# EAGLE design GreenProbe (EAGLE 9.7.0)
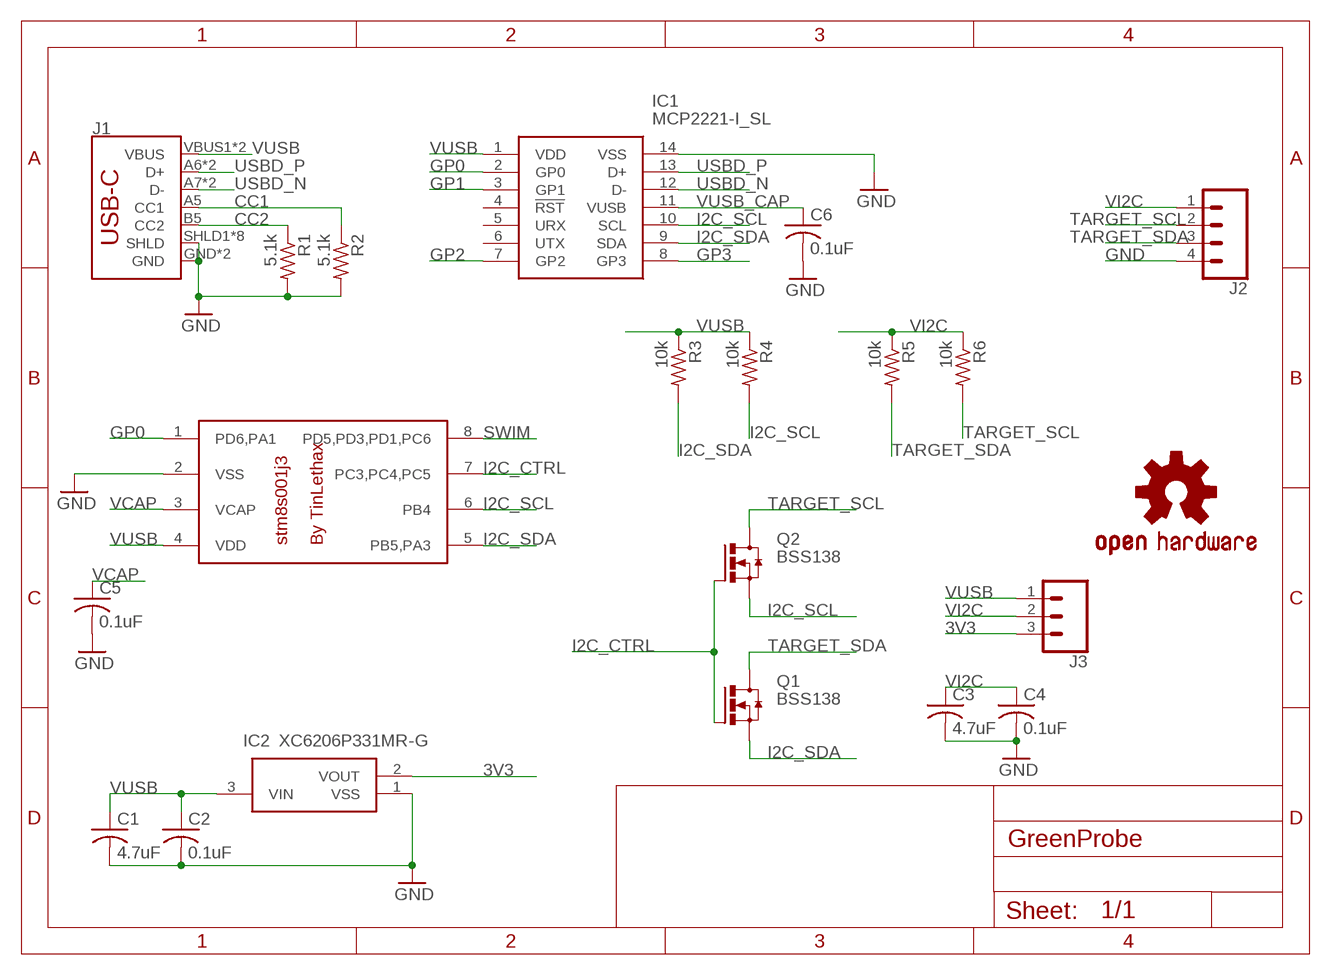
[diagram p0: schematic, sheet 1]

## Parts
C1  4.7uF  C-USC0603  [C0603]
C2  0.1uF  C-USC0603  [C0603]
C3  4.7uF  C-USC0603  [C0603]
C4  0.1uF  C-USC0603  [C0603]
C5  0.1uF  C-USC0603  [C0603]
C6  0.1uF  C-USC0603  [C0603]
IC1  MCP2221-I_SL  [SOIC127P600X175-14N]
IC2  XC6206P331MR-G  [SOT95P280X130-3N]
IC3  STM8S001J3  [SOP8]
J1  SPARKFUN-CONNECTORS_USB_C16PIN  [SPARKFUN-CONNECTORS_USB-C-16P]
J2  CONN_041X04_NO_SILK  [1X04_NO_SILK]
J3  CONN_031X03_NO_SILK  [1X03_NO_SILK]
LOGO1  OSHW-LOGOMINI  [OSHW-LOGO-MINI]
Q1  BSS138  [SOT23-3]
Q2  BSS138  [SOT23-3]
R1  5.1k  R-US_R0603  [R0603]
R2  5.1k  R-US_R0603  [R0603]
R3  10k  R-US_R0603  [R0603]
R4  10k  R-US_R0603  [R0603]
R5  10k  R-US_R0603  [R0603]
R6  10k  R-US_R0603  [R0603]

## Nets
3V3: IC2.2(VOUT) J3.3
CC1: J1.A5(CC1) R2.1
CC2: J1.B5(CC2) R1.1
GND: C1.2 C2.2 C3.2 C4.2 C5.2 C6.2 IC1.14(VSS) IC2.1(VSS) IC3.2(VSS) J1.GND J1.GND2(GND) J1.SHLD1(SHLD) J1.SHLD2(SHLD) J1.SHLD3(SHLD) J1.SHLD4(SHLD) J1.SHLD5(SHLD) J1.SHLD6(SHLD) J1.SHLD7(SHLD) J1.SHLD8(SHLD) J2.4 R1.2 R2.2
GP0: IC1.2(GP0) IC3.1(PD6,PA1)
GP1: IC1.3(GP1)
GP2: IC1.7(GP2)
GP3: IC1.8(GP3)
I2C_CTRL: IC3.7(PC3,PC4,PC5) Q1.1(G) Q2.1(G)
I2C_SCL: IC1.10(SCL) IC3.6(PB4) Q2.2(S) R4.2
I2C_SDA: IC1.9(SDA) IC3.5(PB5,PA3) Q1.2(S) R3.2
SWIM: IC3.8(PD5,PD3,PD1,PC6)
TARGET_SCL: J2.2 Q2.3(D) R6.2
TARGET_SDA: J2.3 Q1.3(D) R5.2
USBD_N: IC1.12(D-) J1.A7(D-) J1.B7(D-)
USBD_P: IC1.13(D+) J1.A6(D+) J1.B6(D+)
VCAP: C5.1 IC3.3(VCAP)
VI2C: C3.1 C4.1 J2.1 J3.2 R5.1 R6.1
VUSB: C1.1 C2.1 IC1.1(VDD) IC2.3(VIN) IC3.4(VDD) J1.VBUS1(VBUS) J1.VBUS2(VBUS) J3.1 R3.1 R4.1
VUSB_CAP: C6.1 IC1.11(VUSB)
Unconnected: IC1.4(!RST) IC1.5(URX) IC1.6(UTX)

## Library data of the parts
C1-C6 = adafruit:C-US: CAPACITOR, American symbol
IC1 = MCP2221-I_SL:MCP2221-I_SL: USB 2.0 to I2C/UART Converter GPIO SO14 Microchip MCP2221-I/SL, USB Converter, USB 2.0 at 12Mbit/s, 3 5.5 V, 14-Pin SOIC Source: Datasheet <https://datasheet.datasheetarchive.com/originals/distributors/DKDS-15/280084.pdf>; ARROW_PART_NUMBER: MCP2221-I/SL; ARROW_PRICE-STOCK: https://www.arrow.com/en/products/mcp2221-isl/microchip-technology?region=nac; DESCRIPTION: USB 2.0 to I2C/UART Converter GPIO SO14 Microchip MCP2221-I/SL, USB Converter, USB 2.0 at 12Mbit/s, 3 5.5 V, 14-Pin SOIC; HEIGHT: 1.75mm; MANUFACTURER_NAME: Microchip; MANUFACTURER_PART_NUMBER: MCP2221-I/SL; MOUSER_PART_NUMBER: 579-MCP2221-I/SL; MOUSER_PRICE-STOCK: https://www.mouser.co.uk/ProductDetail/Microchip-Technology/MCP2221-I-SL?qs=wzzOUr4NhYrXnl%252BgbTV6ag%3D%3D
IC2 = XC6206P331MR-G:XC6206P331MR-G: LDO Voltage Regulators Source: Datasheet <https://www.torexsemi.com/file/xc6206/XC6206.pdf>; DESCRIPTION: LDO Voltage Regulators; HEIGHT: 1.3mm; MANUFACTURER_NAME: Torex; MANUFACTURER_PART_NUMBER: XC6206P331MR-G; MOUSER_PART_NUMBER: 865-XC6206P331MR-G; MOUSER_PRICE-STOCK: https://www.mouser.co.uk/ProductDetail/Torex-Semiconductor/XC6206P331MR-G?qs=AsjdqWjXhJ%252B7jjWBpr1yow%3D%3D
IC3 = stm8s001j3:STM8S001J3
J1 = USB-C-Breakout:SPARKFUN-CONNECTORS_USB_C: USB Type C 16Pin Connector Super Speed pins not available on the 16-pin purely SMD connector so this part is best for USB 2.0 implementations. D1 and D2 are tied together enabling D+/- no matter which way the cable is plugged into the connector. The two channel configuration pins (CC1/2) are exposed. These are normally connected to ground via 5.1k resistors but can be reconfigured for high current/high power applications.; PROD_ID: CONN-14122
J2 = SparkFun-Connectors:CONN_04: Multi connection point. Often used as Generic Header-pin footprint for 0.1 inch spaced/style header connections On any of the 0.1 inch spaced packages, you can populate with these: Break Away Headers - Straight <https://www.sparkfun.com/products/116> (PRT-00116) Break Away Male Headers - Right Angle <https://www.sparkfun.com/products/553> (PRT-00553) Female Headers <https://www.sparkfun.com/products/115> (PRT-00115) Break Away Headers - Machine Pin <https://www.sparkfun.com/products/117> (PRT-00117) Break Away Female Headers - Swiss Machine Pin <https://www.sparkfun.com/products/743> (PRT-00743) For SCREWTERMINALS and SPRING TERMINALS visit here: Screw Terimnals on SparkFun.com <https://www.sparkfun.com/search/results?term=Screw+Terminals> (5mm/3.5mm/2.54mm spacing) This device is also useful as a general connection point to wire up your design to another part of your project. Our various solder wires solder well into these plated through hole pads. Hook-Up Wire - Assortment (Stranded, 22 AWG) <https://www.sparkfun.com/products/11375> (PRT-11375) Hook-Up Wire - Assortment (Solid Core, 22 AWG) <https://www.sparkfun.com/products/11367> (PRT-11367) View the entire wire category on our website here <https://www.sparkfun.com/categories/141> Special notes: Molex polarized connector foot print use with SKU : PRT-08231 with associated crimp pins and housings. 1MM SMD Version SKU: PRT-10208; PROD_ID: CONN-09696
J3 = SparkFun-Connectors:CONN_03: Multi connection point. Often used as Generic Header-pin footprint for 0.1 inch spaced/style header connections On any of the 0.1 inch spaced packages, you can populate with these: Break Away Headers - Straight <https://www.sparkfun.com/products/116> (PRT-00116) Break Away Male Headers - Right Angle <https://www.sparkfun.com/products/553> (PRT-00553) Female Headers <https://www.sparkfun.com/products/115> (PRT-00115) Break Away Headers - Machine Pin <https://www.sparkfun.com/products/117> (PRT-00117) Break Away Female Headers - Swiss Machine Pin <https://www.sparkfun.com/products/743> (PRT-00743) Stackable Header - 3 Pin (Female, 0.1") <https://www.sparkfun.com/products/13875> (PRT-13875) For SCREWTERMINALS and SPRING TERMINALS visit here: Screw Terimnals on SparkFun.com <https://www.sparkfun.com/search/results?term=Screw+Terminals> (5mm/3.5mm/2.54mm spacing) This device is also useful as a general connection point to wire up your design to another part of your project. Our various solder wires solder well into these plated through hole pads. Hook-Up Wire - Assortment (Stranded, 22 AWG) <https://www.sparkfun.com/products/11375> (PRT-11375) Hook-Up Wire - Assortment (Solid Core, 22 AWG) <https://www.sparkfun.com/products/11367> (PRT-11367) View the entire wire category on our website here <https://www.sparkfun.com/categories/141> Special notes: Molex polarized connector foot print use with SKU : PRT-08232 with associated crimp pins and housings.
LOGO1 = SparkFun-Aesthetics:OSHW-LOGO: Open-Source Hardware (OSHW) Logo This logo indicates the piece of hardware it is found on incorporates a OSHW license and/or adheres to the definition of open source hardware found here: http://freedomdefined.org/OSHW
Q1 Q2 = Transistor:BSS138: MOSFET N-CH 50V 220MA SOT-23 Manufacturer's datasheet <https://www.onsemi.com/pub/Collateral/BSS138-D.PDF>; CREATED_BY: PCBLayout.com; DIGIKEY_PART_NUMBER: BSS138CT-ND; MANUFACTURER: ON Semiconductor; MPN: BSS138; PACKAGE: SOT-23
R1-R6 = adafruit:R-US_: RESISTOR, American symbol

## Board
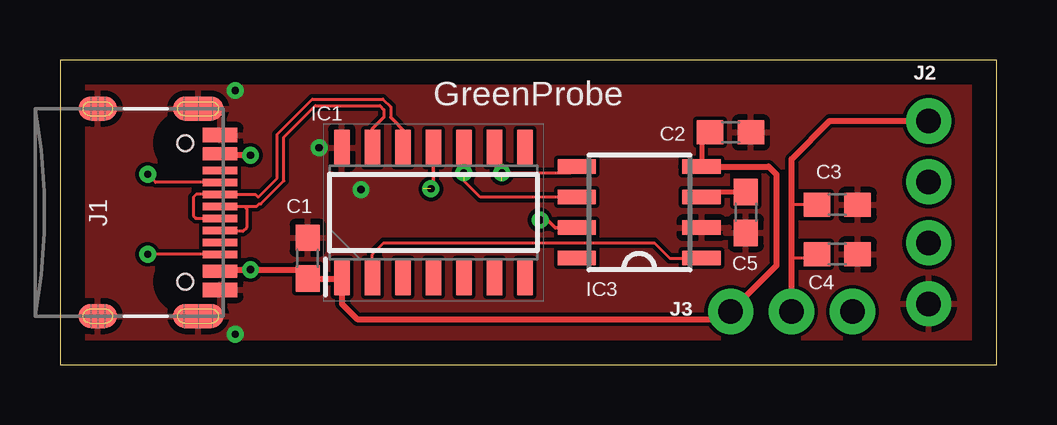
[diagram p1: board, top side]
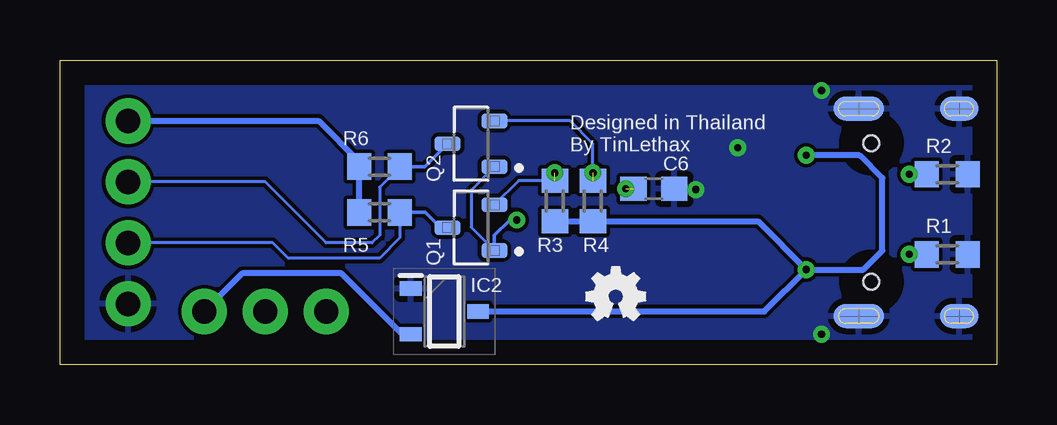
[diagram p2: board, bottom side, seen from below]

Size 39.03 x 12.7 mm. Coordinates in mm from the lower left corner, seen from the top.
Outline: 0,0 39.03,0 39.03,12.7 0,12.7 0,0
Copper layers (1*16): Top 0.035mm / dielectric 1.5mm / Bottom 0.035mm
Design rules "default": minimum track width 6mil, minimum drill 0.35mm, track to track 6mil, track to pad 6mil, pad to pad 6mil, via to via 6mil, smd to smd 6mil, copper to edge 40mil, drill to drill 6mil, minimum pad ring 10mil, minimum via ring 8mil, stop-mask expansion 4mil, vias tented up to drill 0mil, thermal gap 10mil

### Footprints (pad centres in the part's own frame; a part is rotated, then mirrored left to right if it is on the bottom)
C0603 = smd 1.1 x 1: 1 -0.85,0; 2 0.85,0
SOIC127P600X175-14N = smd 1.5 x 0.65: 1 -2.7,3.81; 2 -2.7,2.54; 3 -2.7,1.27; 4 -2.7,0; 5 -2.7,-1.27; 6 -2.7,-2.54; 7 -2.7,-3.81; 8 2.7,-3.81; 9 2.7,-2.54; 10 2.7,-1.27; 11 2.7,0; 12 2.7,1.27; 13 2.7,2.54; 14 2.7,3.81
SOT95P280X130-3N = smd 0.9 x 0.6: 1 -1.4,0.95; 2 -1.4,-0.95; 3 1.4,0
SOP8 = smd 0.6 x 1.6: 1 -1.905,-2.6; 2 -0.635,-2.6; 3 0.635,-2.6; 4 1.905,-2.6; 5 1.905,2.6; 6 0.635,2.6; 7 -0.635,2.6; 8 -1.905,2.6
SPARKFUN-CONNECTORS_USB-C-16P = smd 0.3 x 1.45: A5 -1.25,0; A6 -0.25,0; A7 0.25,0; A8 1.25,0; B5 1.75,0; B6 0.75,0; B7 -0.75,0; B8 -1.75,0 | smd 0.6 x 1.45: GND -3.225,0; GND2 3.225,0 | smd 1 x 2.1: SHLD1 -4.32,-0.915; SHLD2 4.32,-0.915 | smd 1 x 2.1 bottom: SHLD3 -4.32,-0.915; SHLD4 4.32,-0.915 | smd 1 x 1.6: SHLD5 -4.32,-5.095; SHLD8 4.32,-5.095 | smd 1 x 1.6 bottom: SHLD6 -4.32,-5.095; SHLD7 4.32,-5.095 | smd 0.55 x 1.45: VBUS1 -2.45,0; VBUS2 2.45,0 | hole 0.65: -2.89,-1.445; 2.89,-1.445
1X04_NO_SILK = drill 1.016 pad 1.88: 1 0,0; 2 2.54,0; 3 5.08,0; 4 7.62,0
1X03_NO_SILK = drill 1.016 pad 1.88: 1 0,0; 2 2.54,0; 3 5.08,0
SOT23-3 = smd 0.62 x 1.1: 1 -0.95,-0.975; 2 0.95,-0.975; 3 0,0.975
R0603 = smd 1 x 1.1: 1 -0.85,0; 2 0.85,0

### Placement (x,y rotation side)
C1  10.32,4.45 90 top
C2  27.94,9.68 0 top
C3  32.38,6.67 0 top
C4  32.38,4.6 0 top
C5  28.57,6.35 270 top
C6  14.29,7.33 0 bottom
IC1  15.56,6.35 90 top
IC2  23.02,2.22 0 bottom
IC3  24.13,6.35 90 top
J1  6.67,6.35 270 top
J2  36.2,10.16 270 top
J3  27.94,2.22 0 top
LOGO1  15.88,2.86 0 bottom
Q1  21.91,5.71 90 bottom
Q2  21.91,9.21 90 bottom
R1  2.06,4.6 0 bottom
R2  2.06,7.94 0 bottom
R3  18.41,6.83 90 bottom
R4  16.83,6.83 90 bottom
R5  25.72,6.35 0 bottom
R6  25.72,8.26 0 bottom

### Tracks (layer width: path | path; a pad name or v marks a point on that pad's centre or on a via)
3V3
  Bottom 0.254: IC2.2 24.77,1.27 27.31,3.81 31.43,3.81 J3.3
CC1  (via drill 0.3)
  Top 0.127: J1.A5 3.99,7.6 v3.65,7.94
  Bottom 0.127: v3.65,7.94 R2.1
CC2  (via drill 0.3)
  Top 0.127: J1.B5 v3.65,4.6
  Bottom 0.127: v3.65,4.6 R1.1
GND  (via drill 0.3)
  other vias: 10.79,9.05 7.3,11.43 7.3,1.27 12.54,7.3
  pour Top: 0.13,0.13 38.93,0.13 38.93,12.57 0.13,12.57
  pour Bottom: 0.13,0.13 38.93,0.13 38.93,12.57 0.13,12.57
GP0
  Top 0.127: IC1.2 13.02,4.6 13.49,5.08 24.77,5.08 25.4,4.45 IC3.1
I2C_CTRL  (via drill 0.3)
  Top 0.152: v20,6.03 20.32,6.03 20.64,5.71 IC3.7
  Bottom 0.127: Q2.1 21.91,7.28 21.91,5.74 Q1.1
  Bottom 0.152: Q1.1 20.93,5.4 20.3,6.03 v20,6.03
I2C_SCL  (via drill 0.3)  (1 unrouted)
  Top 0.127: IC1.10 v16.83,7.99 R4.2 17.52,6.99 IC3.6
  Bottom 0.127: R4.2 16.83,9.21 17.78,10.16 Q2.2
I2C_SDA  (via drill 0.3)  (1 unrouted)
  Top 0.127: IC1.9 18.1,8.31 v18.41,7.99 21.27,7.99 IC3.5
  Bottom 0.127: R3.2 19.92,7.68 Q1.2
TARGET_SCL
  Bottom 0.127: R6.2 25.72,7.41 25.72,5.4 26.04,5.08 27.94,5.08 30.48,7.62 J2.2
  Bottom 0.152: R6.2 23.84,8.26 Q2.3
TARGET_SDA
  Bottom 0.127: R5.2 24.87,5.29 25.72,4.45 29.53,4.45 30.16,5.08 J2.3
  Bottom 0.152: Q1.3 23.18,5.71 23.81,6.35 R5.2 25.08,6.13
USBD_N
  Top 0.127: J1.A7 5.65,6.1 5.56,6.19 5.56,6.99 5.67,7.1 J1.B7 8.14,7.1 8.25,6.99 9.05,7.78 9.05,9.6 10.52,11.07 13.45,11.07 13.77,10.75 13.77,10.32
  Top 0.152: IC1.12 14.29,9.8 13.9,10.19 13.77,10.32
USBD_P
  Top 0.127: J1.B6 6.71,5.56 7.62,5.56 7.78,5.71 7.78,6.51 7.69,6.6 J1.A6 8.19,6.6 8.29,6.71 8.37,6.71 9.33,7.66 9.33,9.49 10.64,10.79 13.33,10.79 13.49,10.64 13.49,10.32
  Top 0.152: IC1.13 13.02,9.83 13.37,10.19 13.49,10.32
VCAP
  Top 0.203: IC3.3 26.95,7.2 C5.1
VI2C
  Top 0.127: C3.1 30.48,6.67 | C4.1 31.38,4.45 30.48,4.45
  Top 0.254: J3.2 30.48,4.45 30.48,6.67 30.48,8.57 32.07,10.16 J2.1
  Bottom 0.254: R5.1 R6.1 26.57,8.47 28.26,10.16 J2.1
VUSB  (via drill 0.3)
  Top 0.203: C2.1 26.73,9.32 IC3.4
  Top 0.254: J1.VBUS2 6.74,3.97 v7.94,3.97 9.95,3.97 C1.1 11.69,3.6 IC1.1 11.75,2.54 12.38,1.91 27.62,1.91 J3.1 29.84,4.13 29.84,7.94 29.53,8.26 IC3.4 26.04,8.26 | v7.94,8.73 6.74,8.73 J1.VBUS1
  Bottom 0.254: v7.94,3.97 5.56,3.97 4.76,4.76 4.76,7.78 5.72,8.73 v7.94,8.73 | R3.1 R4.1 9.95,5.98 v7.94,3.97 | IC2.3 9.68,2.22 v7.94,3.97
VUSB_CAP  (via drill 0.3)  (1 unrouted)
  Top 0.152: IC1.11 15.56,7.3 15.48,7.3 v15.45,7.33

### Text on the board
tNames: GreenProbe
bNames: Designed in Thailand / By TinLethax